# EasyEDA Pro project 电磁循迹_V1.0.eprj

# Schematic 电磁循迹
Create Date: 2023-04-10; Page Name: P1; Project Name: 逐飞电磁; Schematic Name: Schematic1; Update Date: 2023-04-10; Company: 嘉立创EDA; Page Size: B; Version: V1.0
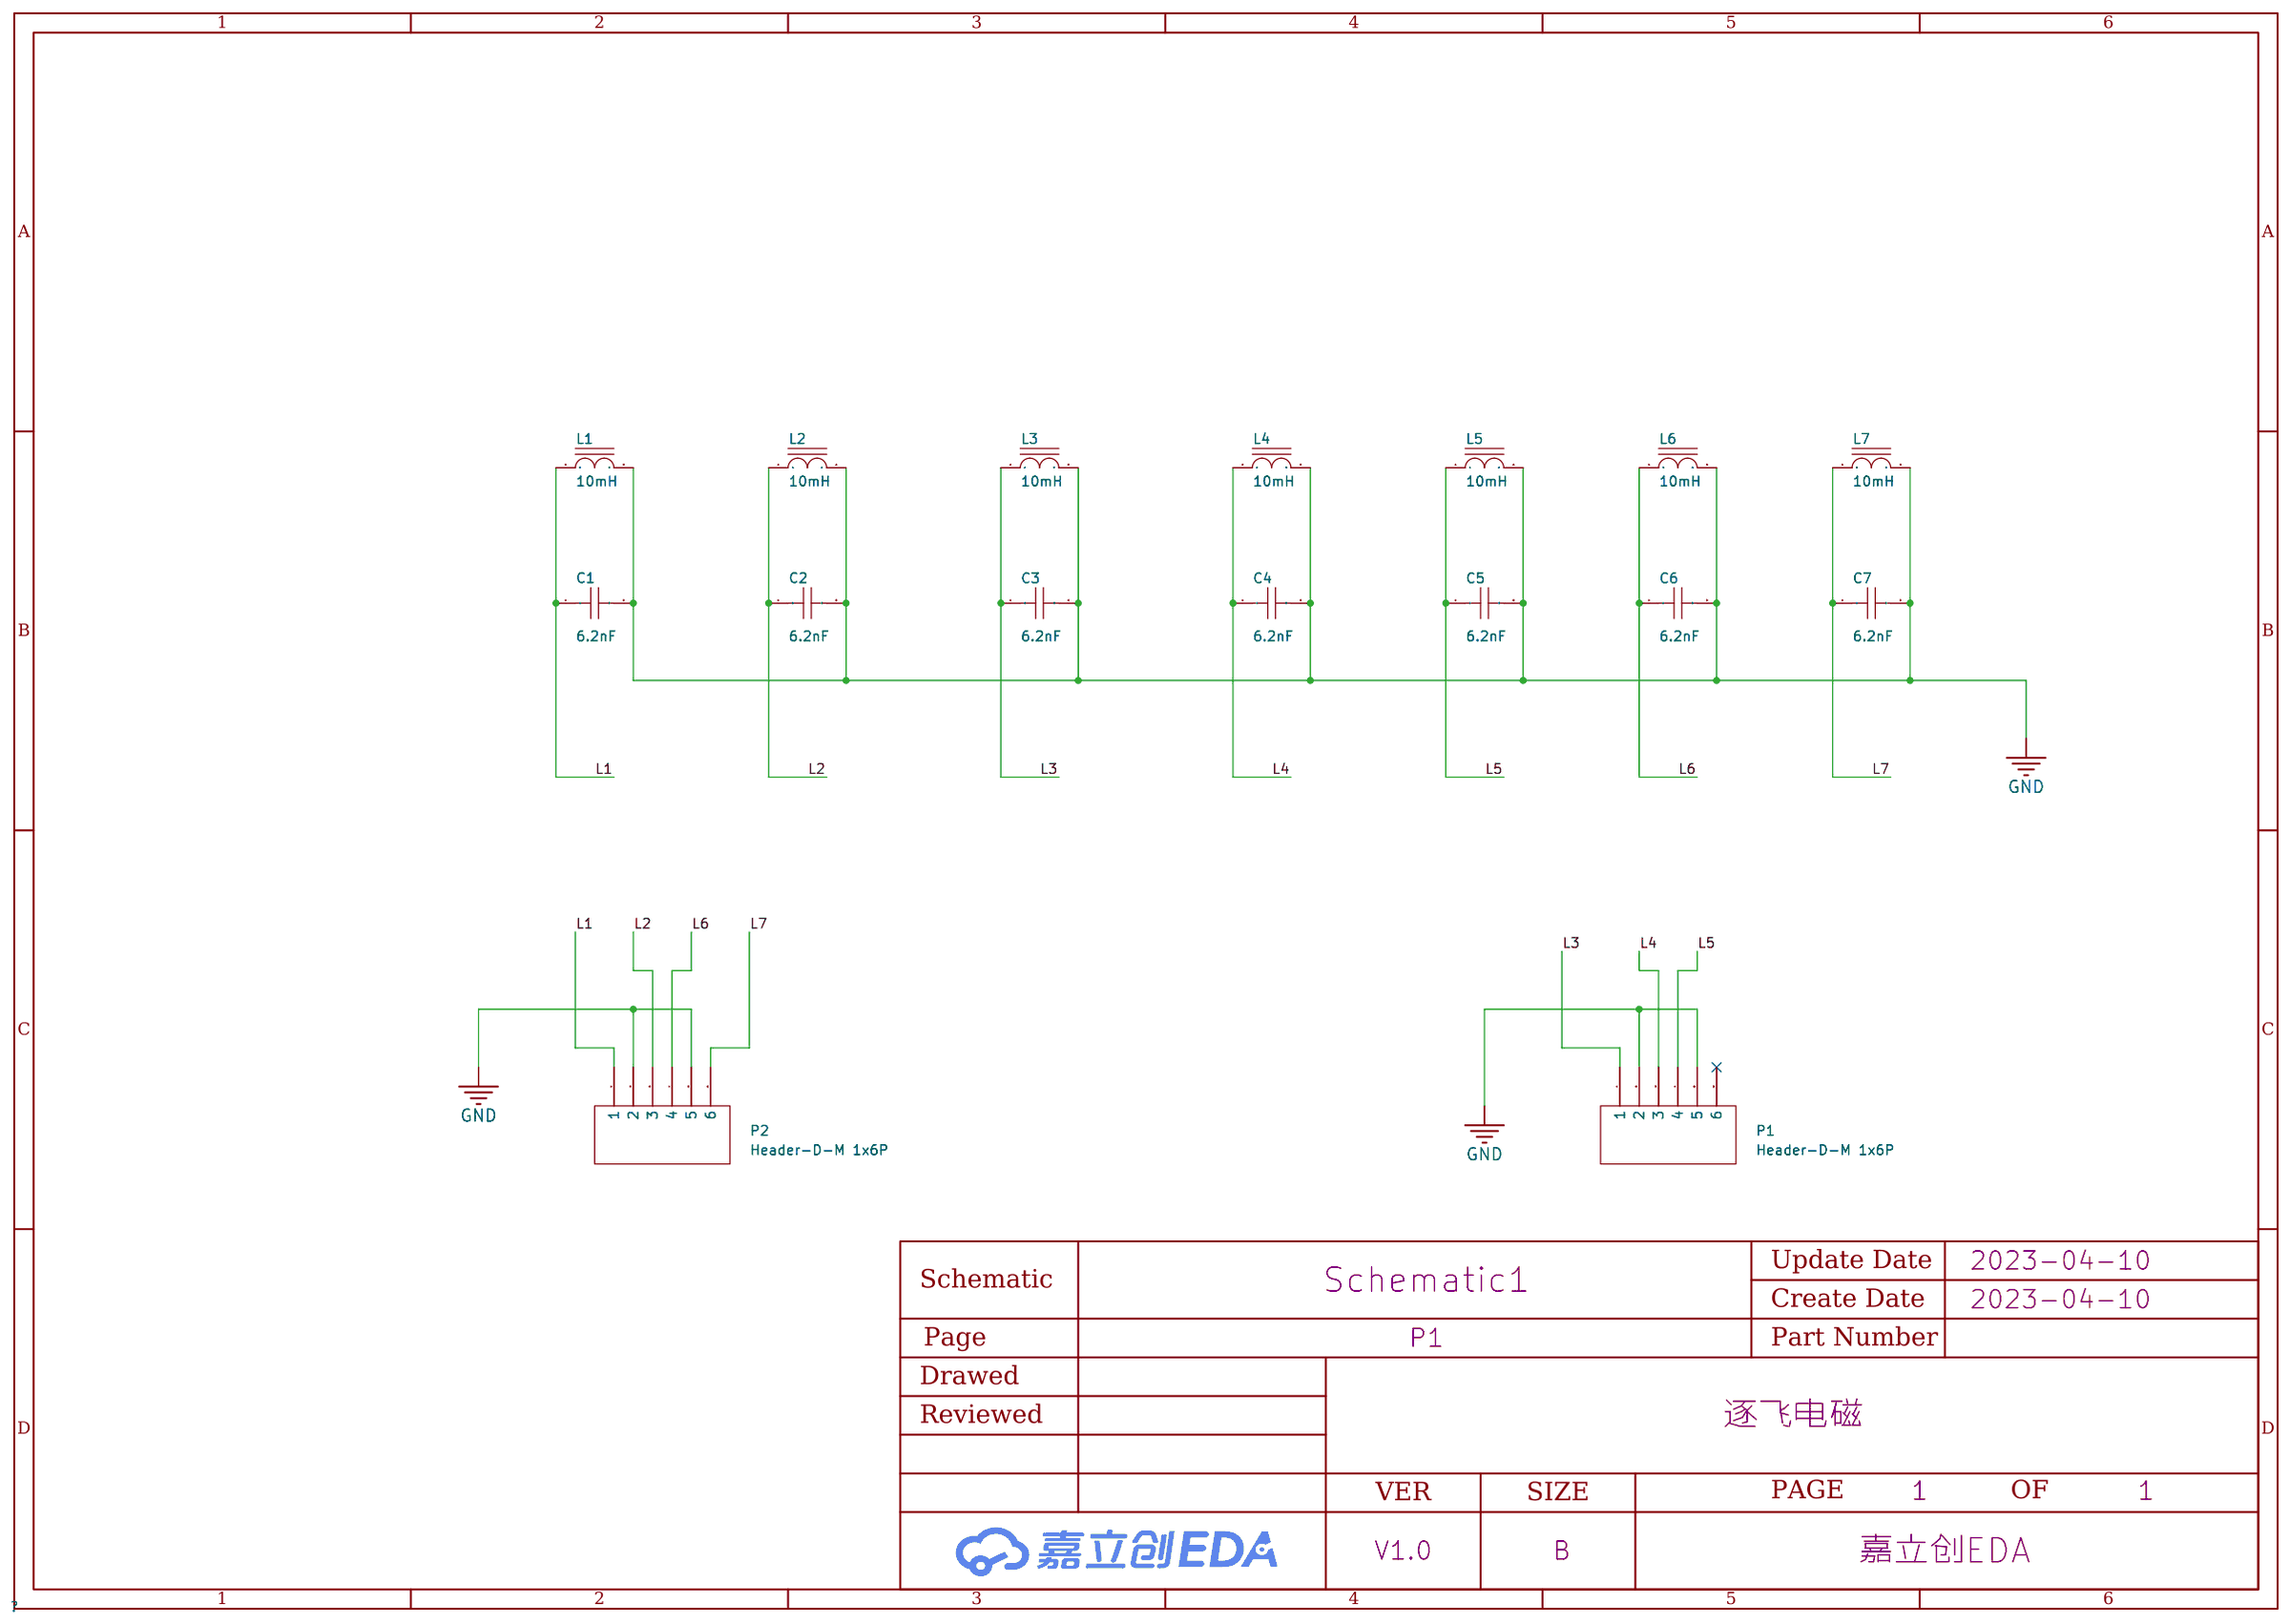
[diagram p0: schematic sheet]

## Parts
C1  6.2nF  [C0805]
C2  6.2nF  [C0805]
C3  6.2nF  [C0805]
C4  6.2nF  [C0805]
C5  6.2nF  [C0805]
C6  6.2nF  [C0805]
C7  6.2nF  [C0805]
L1  10mH  [LD8x10]
L2  10mH  [LD8x10]
L3  10mH  [LD8x10]
L4  10mH  [LD8x10]
L5  10mH  [LD8x10]
L6  10mH  [LD8x10]
L7  10mH  [LD8x10]
P1  Header-D-M 1x6P  [HDR1X6-M]
P2  Header-D-M 1x6P  [HDR1X6-M]

## Library data of the parts
C1-C7 = 0805B622K500NT: 容值:6.2nF;精度:±10%;额定电压:50V;材质(温度系数):X7R;额定电压(VAC):-;; LCSC Part Name: 6.2nF ±10% 50V; Supplier Part: C3037648; Manufacturer: FH(风华); Supplier Footprint: 0805; Datasheet: https://atta.szlcsc.com/upload/public/pdf/source/20200305/C486355_26A10D38EF8C2A5C37091D0039909270.pdf; Supplier: LCSC; Tolerance: ±10%; Voltage Rated: 50V; Temperature Coefficient: X7R
L1-L7 = Ind-Power: Published: 8-Jun-2000; Revision: July-2002: Re-released for DXP Platform.; Publisher: Altium Limited; Imax: 50mA; DCR: .5m; Price(RMB): 0.000
P1 P2 = Header-D-M 1x6P: Revision: V1.0

## Nets
GND: C1.2 C2.2 C3.2 C4.2 C5.2 C6.2 C7.2 L1.2 L2.2 L3.2 L4.2 L5.2 L6.2 L7.2 P1.2 P1.5 P2.2 P2.5
L1: C1.1 L1.1 P2.1
L2: C2.1 L2.1 P2.3
L3: C3.1 L3.1 P1.1
L4: C4.1 L4.1 P1.3
L5: C5.1 L5.1 P1.4
L6: C6.1 L6.1 P2.4
L7: C7.1 L7.1 P2.6

Not connected (* = marked no-connect by the designer): P1 6*

# Board 电磁循迹
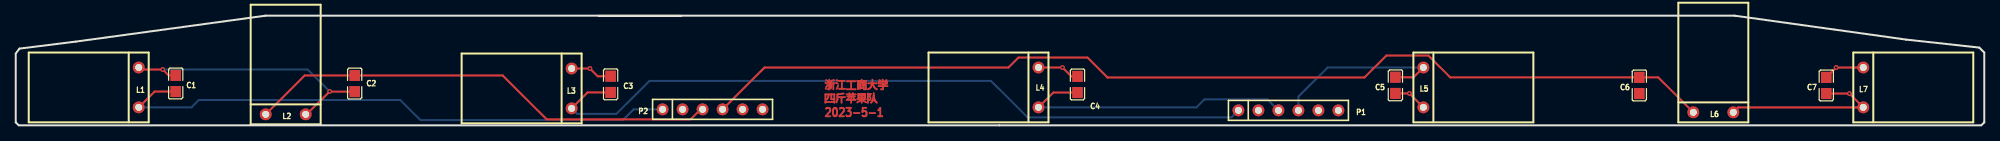
[diagram p1: board, top side]
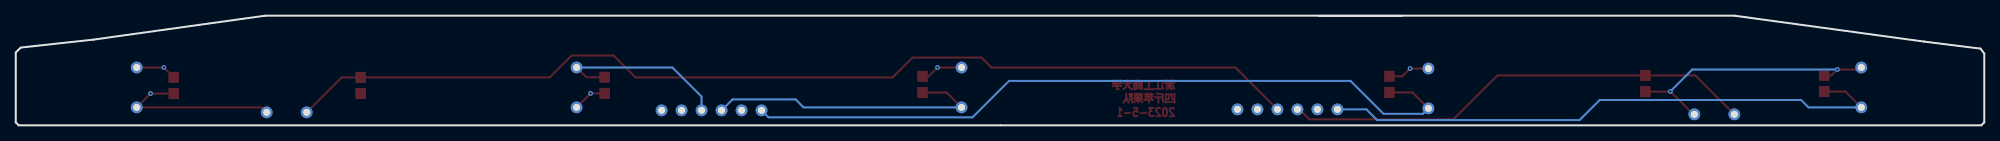
[diagram p2: board, bottom side, seen from below]

Outline 250.06 x 13.97 mm; copper layers: Top Layer, Bottom Layer. Coordinates in mm from the lower left corner of the outline.
Outline path: 0,0.63 0,9.14 0.47,9.77 7.62,10.67 31.7,13.97 218.36,13.97 240.16,10.92 249.43,9.91 250.06,9.27 250.06,0.38 249.68,0 0.38,0 0,0.38 0,0.51 ; 74.02,13.95 84.52,13.95
Stack: Top Layer 0.035mm / Dielectric1 1.51mm FR4 er 4.5 / Bottom Layer 0.035mm

## Design rules (mm)
spacing safeClearance (default): track to track 0.152, other pairs 0.152 to 0.3
track width trackWidth (default): min 0.127, default 0.254, max 2.54
differential pair differentialPair (default): width min 0.127, default 0.254, max 2.54; gap min 0.152, default 0.152
via viaSize (default): diameter min 0.5, default 0.61, max 10; hole min 0.3, default 0.305, max 6

## Placement (name value [footprint] x y rotation side)
C1  6.2nF  [C0805]  20.32 5.33 90 top
C2  6.2nF  [C0805]  43.05 5.32 270 top
C3  6.2nF  [C0805]  75.56 5.22 90 top
C4  6.2nF  [C0805]  134.87 5.21 90 top
C5  6.2nF  [C0805]  175.26 5.09 270 top
C6  6.2nF  [C0805]  206.25 5.08 270 top
C7  6.2nF  [C0805]  230 5.08 270 top
L1  10mH  [LD8x10]  15.62 4.83 90 top
L2  10mH  [LD8x10]  34.29 1.4 0 top
L3  10mH  [LD8x10]  70.61 4.7 90 top
L4  10mH  [LD8x10]  129.92 4.83 90 top
L5  10mH  [LD8x10]  178.82 4.83 270 top
L6  10mH  [LD8x10]  215.65 1.65 0 top
L7  10mH  [LD8x10]  234.7 4.83 270 top
P1  Header-D-M 1x6P  [HDR1X6-M]  155.32 1.9 0 top
P2  Header-D-M 1x6P  [HDR1X6-M]  82.17 2.03 0 top

## Footprints (pads in the part's own frame, mm; a bottom-side part is the same pattern mirrored in y, then rotated)
C0805
  rect 1.41x1.35 smd: 1(-1.03,0) 2(1.03,0)
HDR1X6-M
  round 1.5 hole 0.9: 1(0,0) 2(2.54,0) 3(5.08,0) 4(7.62,0) 5(10.16,0) 6(12.7,0)
LD8x10
  round 1.5 hole 0.9: 1(-2.54,0) 2(2.54,0)

## Nets
As in the schematic.

Pads without a net: P1 6

## Via types
v1: diameter 0.61, hole 0.305, Top Layer to Bottom Layer, 7 vias

## Routing (per net, layer and track width the routed paths; a pad name or vN(x,y) marks a point on that pad's centre or on a via; arc(x,y) is an arc through that point)
GND: length 72.2
  Top Layer w0.254: L6.2 218.82,2.29 L7.2 v1(232.93,4.05) C7.2 ; L1.2 15.88,7.11 v1(18.67,7.11) 19.42,6.36 C1.2 ; L3.2 v1(72.94,7.24) 73.93,6.25 C3.2 ; L4.2 v1(132.97,7.37) 134.1,6.24 C4.2 ; L5.2 v1(177.04,4.06) C5.2 ; C2.2 39.91,4.29 v1(39.88,4.32) 36.96,1.4 L2.2
  Bottom Layer w0.254: v1(18.67,7.11) 37.08,7.11 v1(39.88,4.32)
L1: length 74.1
  Top Layer w0.254: L1.1 17.64,4.3 C1.1
  Bottom Layer w0.254: P2.1 78.49,2.03 77.12,0.67 51.4,0.67 48.84,3.23 23.27,3.23 22.33,2.29 L1.1
L2: length 60.4
  Top Layer w0.254: L2.1 36.7,6.35 C2.1 61.85,6.35 67.44,0.76 85.72,0.76 87,2.03 P2.3
L3: length 94.8
  Top Layer w0.254: L3.1 72.64,4.19 C3.1
  Bottom Layer w0.254: L3.1 71.31,1.46 76.3,1.46 80.5,5.65 123.89,5.65 128.52,1.02 154.43,1.02 P1.1
L4: length 37.2
  Top Layer w0.254: L4.1 131.81,4.18 C4.1
  Bottom Layer w0.254: P1.3 159,3.3 151,3.3 149.99,2.29 L4.1
L5: length 23.2
  Top Layer w0.254: L5.1 177.57,6.12 C5.1
  Bottom Layer w0.254: L5.1 166.65,7.37 162.94,3.66 P1.4
L6: length 131.3
  Top Layer w0.254: P2.4 95.12,7.37 126.11,7.37 127.38,8.64 136.14,8.64 138.68,6.1 171.32,6.1 174.12,8.89 179.45,8.89 182.23,6.11 C6.1 208.65,6.11 L6.1
L7: length 5.2
  Top Layer w0.254: L7.1 v1(231.25,7.37) C7.1

## Copper pours and planes (outline as drawn; the poured copper is in the pictures)
GND on Top Layer: -7.24,23.11 249.94,23.11 249.94,-4.06 -7.24,-4.06
L7 on Bottom Layer: 93.47,16.13 250.19,16.13 250.19,-2.92 93.47,-2.92

## Text on the board
Top Layer: 浙江工商大学 / 四斤苹果队 / 2023-5-1
